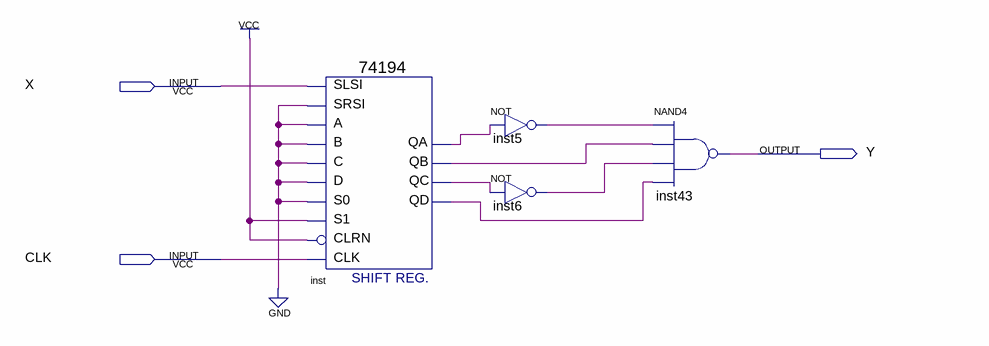
[diagram p0: schematic sheet]
// Quartus schematic DetSeq.bdf as structural Verilog: 4 symbols, 3 pins
module DetSeq (
  input  X,
  input  CLK,
  output Y
);

  wire inst5_out, inst6_out, inst_qa, inst_qb, inst_qc, inst_qd;

  \74194  inst (
    .SLSI(X), .SRSI(1'b0), .B(1'b0), .C(1'b0), .CLK(CLK), .CLRN(1'b1), .D(1'b0), .S1(1'b1), .S0(1'b0),
    .A(1'b0), .QA(inst_qa), .QB(inst_qb), .QC(inst_qc), .QD(inst_qd));
  not inst5 (inst5_out, inst_qa);
  not inst6 (inst6_out, inst_qc);
  nand inst43 (Y, inst5_out, inst_qb, inst6_out, inst_qd);
endmodule
